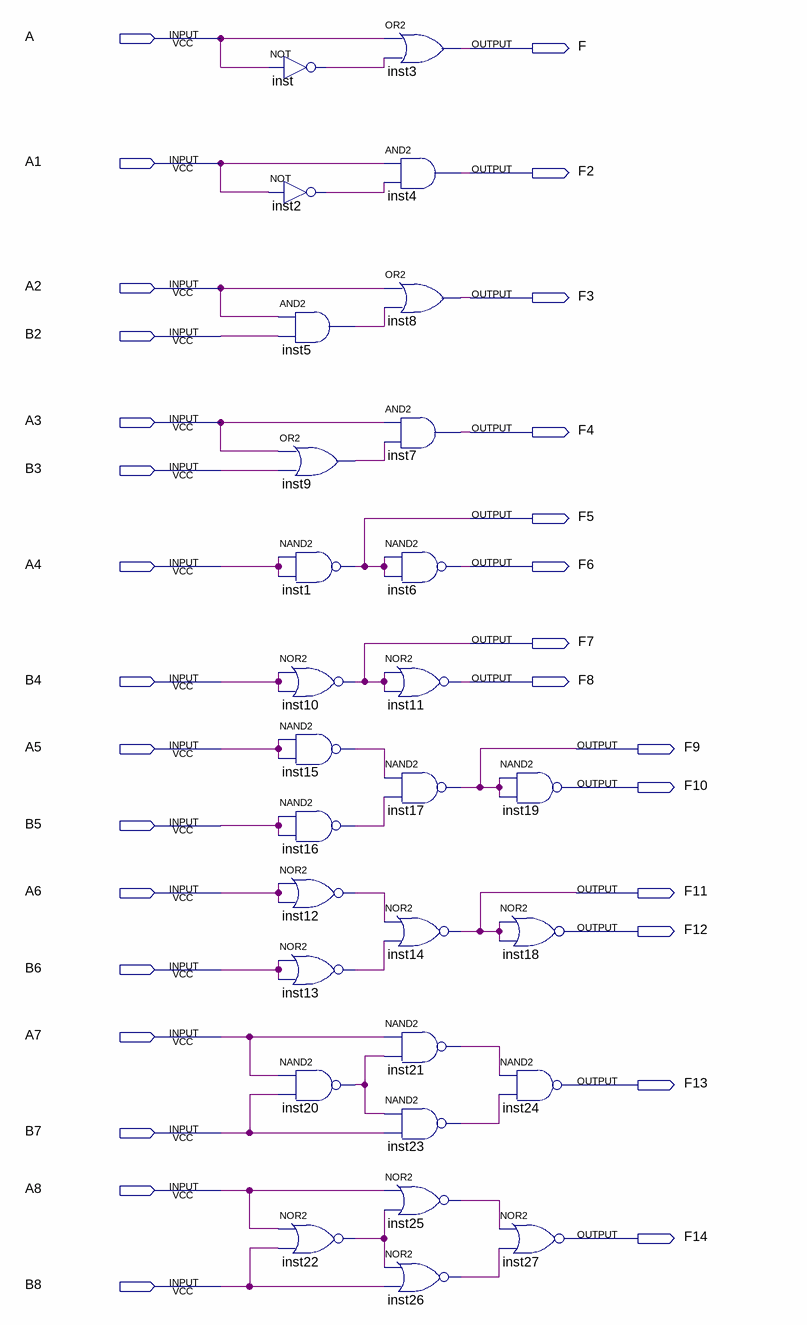
[diagram p0: schematic sheet]
// Quartus schematic Boolean.bdf as structural Verilog: 28 symbols, 30 pins
module Boolean (
  input  A,
  input  A1,
  input  A2,
  input  B2,
  input  A3,
  input  B3,
  input  A4,
  input  B4,
  input  A5,
  input  B5,
  input  A6,
  input  B6,
  input  A7,
  input  B7,
  input  A8,
  input  B8,
  output F,
  output F2,
  output F3,
  output F4,
  output F5,
  output F6,
  output F7,
  output F8,
  output F9,
  output F10,
  output F11,
  output F12,
  output F13,
  output F14
);

  wire inst2_out, inst5_out, inst9_out, inst12_out, inst13_out, inst15_out, inst16_out, inst20_out,
       inst21_out, inst22_out, inst23_out, inst25_out, inst26_out, inst_out;

  not inst (inst_out, A);
  not inst2 (inst2_out, A1);
  and inst5 (inst5_out, A2, B2);
  or inst9 (inst9_out, A3, B3);
  nand inst1 (F5, A4, A4);
  nor inst10 (F7, B4, B4);
  nand inst15 (inst15_out, A5, A5);
  nand inst16 (inst16_out, B5, B5);
  nor inst12 (inst12_out, A6, A6);
  nor inst13 (inst13_out, B6, B6);
  nand inst20 (inst20_out, A7, B7);
  nor inst22 (inst22_out, A8, B8);
  or inst3 (F, A, inst_out);
  and inst4 (F2, A1, inst2_out);
  or inst8 (F3, A2, inst5_out);
  and inst7 (F4, A3, inst9_out);
  nand inst6 (F6, F5, F5);
  nor inst11 (F8, F7, F7);
  nand inst17 (F9, inst15_out, inst16_out);
  nor inst14 (F11, inst12_out, inst13_out);
  nand inst21 (inst21_out, A7, inst20_out);
  nand inst23 (inst23_out, inst20_out, B7);
  nor inst25 (inst25_out, A8, inst22_out);
  nor inst26 (inst26_out, inst22_out, B8);
  nand inst19 (F10, F9, F9);
  nor inst18 (F12, F11, F11);
  nand inst24 (F13, inst21_out, inst23_out);
  nor inst27 (F14, inst25_out, inst26_out);
endmodule
